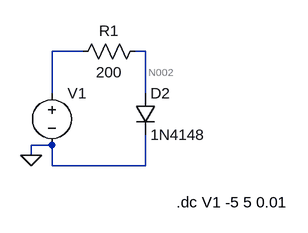
[diagram p0: schematic 121_1N4148.asc]
121_1N4148.asc, the LTspice schematic file:
Version 4
SHEET 1 880 680
WIRE 224 240 176 240
WIRE 320 240 304 240
WIRE 176 304 176 240
WIRE 320 304 320 240
WIRE 176 384 144 384
WIRE 144 400 144 384
WIRE 176 416 176 384
WIRE 320 416 320 368
WIRE 320 416 176 416
FLAG 144 400 0
SYMBOL voltage 176 288 R0
SYMATTR InstName V1
SYMATTR Value ""
SYMBOL diode 304 304 R0
SYMATTR InstName D2
SYMATTR Value 1N4148
SYMBOL Res 320 224 R90
WINDOW 0 0 56 VBottom 2
WINDOW 3 32 56 VTop 2
SYMATTR InstName R1
SYMATTR Value 200
TEXT 368 472 Left 2 !.dc V1 -5 5 0.01

The netlist it stands for:
* 121_1N4148.asc
V1 N001 0
D2 N002 0 1N4148
R1 N002 N001 200
.model D D
.lib standard.dio
.dc V1 -5 5 0.01
.backanno
.end

* Results of the author's LTspice run, read from the files saved beside the schematic
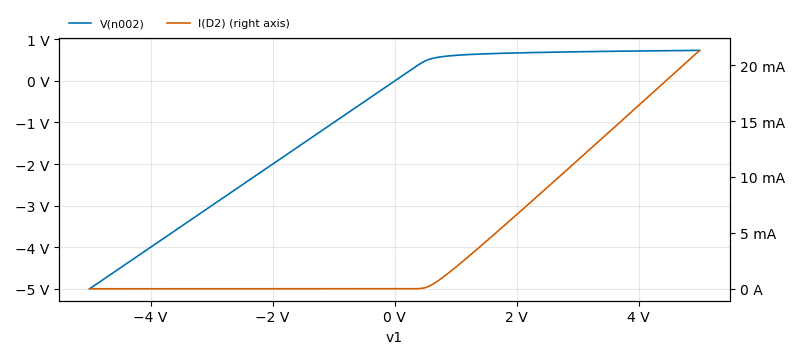
[diagram p1: DC transfer characteristic of 121_1N4148.asc, plotted from the saved traces]
* DC transfer characteristic, 1 run:
*   V(n002): -5 V at v1=-5 V, 734.9 mV at v1=5 V, min -5 V, max 734.9 mV
*   I(D2): -2.525 nA at v1=-5 V, 21.33 mA at v1=5 V, min -2.525 nA, max 21.33 mA